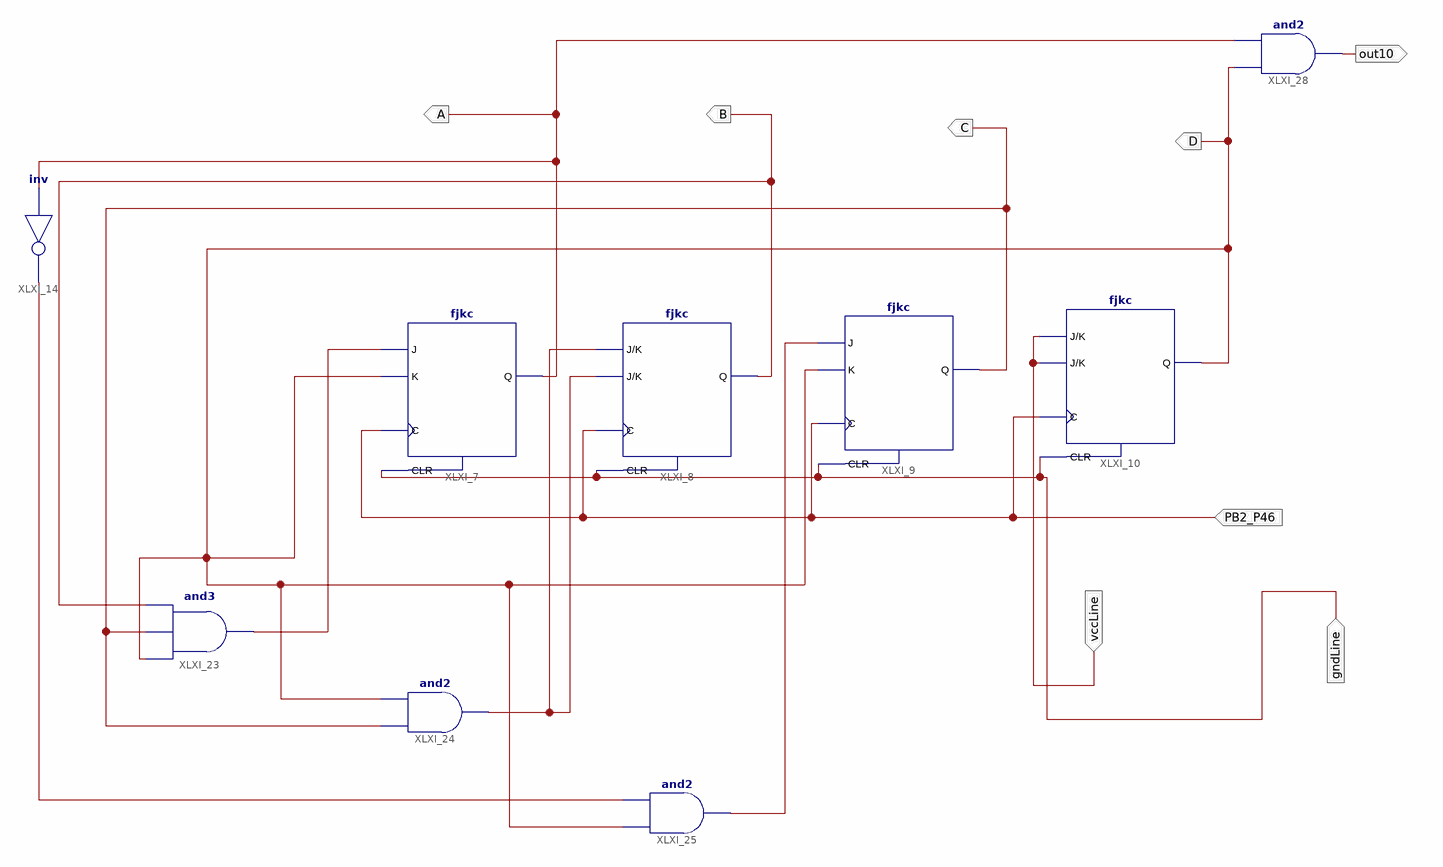
[diagram p0: schematic sheet 1]
// Xilinx ISE schematic Mod10.sch (spartan6) as structural Verilog: 9 symbols, 8 ports
module Mod10 (
  input  PB2_P46,
  input  vccLine,
  input  gndLine,
  output A,
  output B,
  output C,
  output D,
  output out10
);

  wire XLXN_11, XLXN_32, XLXN_34, XLXN_38;

  not XLXI_14 (XLXN_11, A);
  fjkc XLXI_7 (.C(PB2_P46), .CLR(gndLine), .J(XLXN_32), .K(D), .Q(A));
  fjkc XLXI_8 (.C(PB2_P46), .CLR(gndLine), .J(XLXN_34), .K(XLXN_34), .Q(B));
  fjkc XLXI_9 (.C(PB2_P46), .CLR(gndLine), .J(XLXN_38), .K(D), .Q(C));
  fjkc XLXI_10 (.C(PB2_P46), .CLR(gndLine), .J(vccLine), .K(vccLine), .Q(D));
  and XLXI_23 (XLXN_32, D, C, B);
  and XLXI_24 (XLXN_34, C, D);
  and XLXI_25 (XLXN_38, D, XLXN_11);
  and XLXI_28 (out10, D, A);
endmodule
